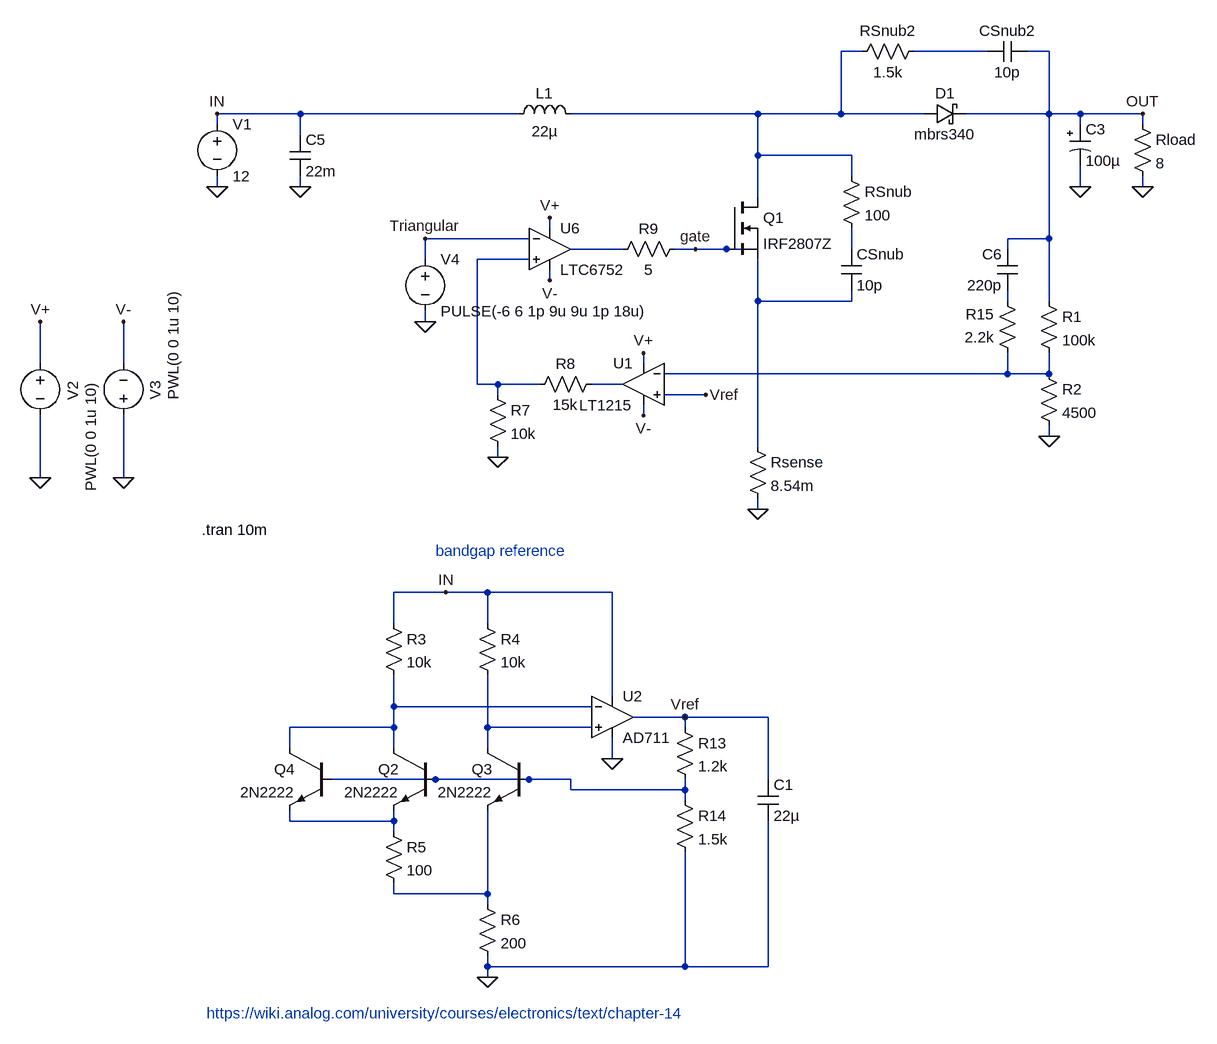
[diagram p0: schematic Boost2_liviana.asc]
Boost2_liviana.asc, the LTspice schematic file:
Version 4
SHEET 1 1128 1560
WIRE 576 -48 544 -48
WIRE 768 -48 656 -48
WIRE 864 -48 832 -48
WIRE -288 48 -416 48
WIRE 48 48 -288 48
WIRE 416 48 128 48
WIRE 544 48 544 -48
WIRE 544 48 416 48
WIRE 672 48 544 48
WIRE 864 48 864 -48
WIRE 864 48 736 48
WIRE 912 48 864 48
WIRE 1008 48 912 48
WIRE -416 64 -416 48
WIRE 912 64 912 48
WIRE 1008 64 1008 48
WIRE -288 80 -288 48
WIRE 416 112 416 48
WIRE 560 112 416 112
WIRE 560 144 560 112
WIRE -416 160 -416 144
WIRE -288 160 -288 144
WIRE 912 160 912 128
WIRE 1008 160 1008 144
WIRE 416 176 416 112
WIRE 96 224 96 208
WIRE 64 240 -96 240
WIRE 864 240 864 48
WIRE 864 240 800 240
WIRE 208 256 128 256
WIRE 320 256 288 256
WIRE 368 256 320 256
WIRE 400 256 368 256
WIRE 560 256 560 224
WIRE 800 256 800 240
WIRE -96 272 -96 240
WIRE 64 272 -16 272
WIRE 96 304 96 288
WIRE 416 336 416 272
WIRE 560 336 560 320
WIRE 560 336 416 336
WIRE 800 336 800 320
WIRE 864 336 864 240
WIRE -96 368 -96 352
WIRE -688 432 -688 368
WIRE -560 432 -560 368
WIRE 240 432 240 416
WIRE 800 448 800 416
WIRE 800 448 272 448
WIRE 864 448 864 416
WIRE 864 448 800 448
WIRE -16 464 -16 272
WIRE 16 464 -16 464
WIRE 80 464 16 464
WIRE 208 464 160 464
WIRE 16 480 16 464
WIRE 336 480 272 480
WIRE 240 512 240 496
WIRE 864 544 864 528
WIRE 416 560 416 336
WIRE 16 576 16 560
WIRE -688 608 -688 512
WIRE -560 608 -560 512
WIRE 416 656 416 640
WIRE -64 784 -144 784
WIRE 0 784 -64 784
WIRE 192 784 0 784
WIRE -144 832 -144 784
WIRE 0 832 0 784
WIRE 192 944 192 784
WIRE -144 960 -144 912
WIRE 160 960 -144 960
WIRE 304 976 224 976
WIRE 432 976 304 976
WIRE -144 992 -144 960
WIRE -144 992 -304 992
WIRE 0 992 0 912
WIRE 160 992 0 992
WIRE 304 992 304 976
WIRE -304 1024 -304 992
WIRE -144 1024 -144 992
WIRE 0 1024 0 992
WIRE 192 1040 192 1008
WIRE -80 1072 -240 1072
WIRE 64 1072 -80 1072
WIRE 128 1072 64 1072
WIRE 432 1072 432 976
WIRE 128 1088 128 1072
WIRE 304 1088 304 1072
WIRE 304 1088 128 1088
WIRE 304 1104 304 1088
WIRE -304 1136 -304 1120
WIRE -144 1136 -144 1120
WIRE -144 1136 -304 1136
WIRE -144 1152 -144 1136
WIRE -144 1248 -144 1232
WIRE 0 1248 0 1120
WIRE 0 1248 -144 1248
WIRE 0 1264 0 1248
WIRE 0 1360 0 1344
WIRE 304 1360 304 1184
WIRE 304 1360 0 1360
WIRE 432 1360 432 1136
WIRE 432 1360 304 1360
WIRE 0 1376 0 1360
FLAG -416 160 0
FLAG 912 160 0
FLAG 1008 160 0
FLAG 864 544 0
FLAG 1008 48 OUT
FLAG -416 48 IN
FLAG 416 656 0
FLAG 320 256 gate
FLAG -288 160 0
FLAG -688 608 0
FLAG -560 608 0
FLAG -688 368 V+
FLAG -560 368 V-
FLAG -96 240 Triangular
FLAG 96 208 V+
FLAG 96 304 V-
FLAG 192 1040 0
FLAG 0 1376 0
FLAG 304 976 Vref
FLAG -64 784 IN
FLAG 336 480 Vref
FLAG 240 512 V-
FLAG 240 416 V+
FLAG 16 576 0
FLAG -96 368 0
SYMBOL nmos 368 176 R0
SYMATTR InstName Q1
SYMATTR Value IRF2807Z
SYMBOL ind 32 64 R270
WINDOW 0 32 56 VTop 2
WINDOW 3 5 56 VBottom 2
SYMATTR InstName L1
SYMATTR Value 22µ
SYMBOL voltage -416 48 R0
WINDOW 123 0 0 Left 2
WINDOW 39 0 0 Left 2
SYMATTR InstName V1
SYMATTR Value 12
SYMBOL schottky 672 64 R270
WINDOW 0 32 32 VTop 2
WINDOW 3 0 32 VBottom 2
SYMATTR InstName D1
SYMATTR Value mbrs340
SYMATTR Description Diode
SYMATTR Type diode
SYMBOL polcap 896 64 R0
WINDOW 3 24 56 Left 2
SYMATTR InstName C3
SYMATTR Value 100µ
SYMATTR Description Capacitor
SYMATTR Type cap
SYMATTR SpiceLine V=2 Irms=3 Rser=0.006 Lser=0 mfg="Rubycon" pn="2SLE100M" type="Al electrolytic"
SYMBOL res 848 320 R0
SYMATTR InstName R1
SYMATTR Value 100k
SYMBOL res 848 432 R0
SYMATTR InstName R2
SYMATTR Value 4500
SYMBOL res 992 48 R0
SYMATTR InstName Rload
SYMATTR Value 8
SYMBOL res 400 544 R0
SYMATTR InstName Rsense
SYMATTR Value 8.54m
SYMBOL cap -304 80 R0
SYMATTR InstName C5
SYMATTR Value 22m
SYMBOL res 544 128 R0
SYMATTR InstName RSnub
SYMATTR Value 100
SYMBOL cap 544 256 R0
SYMATTR InstName CSnub
SYMATTR Value 10p
SYMBOL res 560 -32 R270
WINDOW 0 32 56 VTop 2
WINDOW 3 0 56 VBottom 2
SYMATTR InstName RSnub2
SYMATTR Value 1.5k
SYMBOL cap 768 -32 R270
WINDOW 0 32 32 VTop 2
WINDOW 3 0 32 VBottom 2
SYMATTR InstName CSnub2
SYMATTR Value 10p
SYMBOL Opamps\\LT1215 240 400 M0
SYMATTR InstName U1
SYMBOL res 304 240 R90
WINDOW 0 0 56 VBottom 2
WINDOW 3 32 56 VTop 2
SYMATTR InstName R9
SYMATTR Value 5
SYMBOL voltage -688 416 R0
WINDOW 123 0 0 Left 0
WINDOW 39 0 0 Left 0
WINDOW 0 50 43 VRight 2
WINDOW 3 78 43 VRight 2
SYMATTR InstName V2
SYMATTR Value PWL(0 0 1u 10)
SYMBOL voltage -560 528 R180
WINDOW 0 -49 40 VRight 2
WINDOW 3 -77 40 VRight 2
WINDOW 123 0 0 Left 0
WINDOW 39 0 0 Left 0
SYMATTR InstName V3
SYMATTR Value PWL(0 0 1u 10)
SYMBOL OpAmps\\AD711 192 912 R0
SYMATTR InstName U2
SYMBOL npn -80 1024 M0
SYMATTR InstName Q2
SYMATTR Value 2N2222
SYMBOL npn 64 1024 M0
SYMATTR InstName Q3
SYMATTR Value 2N2222
SYMBOL res -160 816 R0
SYMATTR InstName R3
SYMATTR Value 10k
SYMBOL res -16 816 R0
SYMATTR InstName R4
SYMATTR Value 10k
SYMBOL res -160 1136 R0
SYMATTR InstName R5
SYMATTR Value 100
SYMBOL res -16 1248 R0
SYMATTR InstName R6
SYMATTR Value 200
SYMBOL res 288 976 R0
SYMATTR InstName R13
SYMATTR Value 1.2k
SYMBOL res 288 1088 R0
SYMATTR InstName R14
SYMATTR Value 1.5k
SYMBOL npn -240 1024 M0
SYMATTR InstName Q4
SYMATTR Value 2N2222
SYMBOL res 0 464 R0
SYMATTR InstName R7
SYMATTR Value 10k
SYMBOL res 176 448 R90
WINDOW 0 0 56 VBottom 2
WINDOW 3 32 56 VTop 2
SYMATTR InstName R8
SYMATTR Value 15k
SYMBOL Comparators\\LTC6752 96 192 R0
SYMATTR InstName U6
SYMBOL voltage -96 256 R0
WINDOW 123 0 0 Left 0
WINDOW 39 0 0 Left 0
SYMATTR InstName V4
SYMATTR Value PULSE(-6 6 1p 9u 9u 1p 18u)
SYMBOL cap 816 320 R180
WINDOW 0 24 56 Left 2
WINDOW 3 24 8 Left 2
SYMATTR InstName C6
SYMATTR Value 220p
SYMBOL res 816 432 R180
WINDOW 0 36 76 Left 2
WINDOW 3 36 40 Left 2
SYMATTR InstName R15
SYMATTR Value 2.2k
SYMBOL cap 416 1072 R0
SYMATTR InstName C1
SYMATTR Value 22µ
TEXT -440 688 Left 2 !.tran 10m
TEXT -432 1432 Left 2 ;https://wiki.analog.com/university/courses/electronics/text/chapter-14
TEXT -80 720 Left 2 ;bandgap reference

The netlist it stands for:
* Boost2_liviana.asc
M§Q1 N001 gate N006 N006 IRF2807Z
L1 IN N001 22µ
V1 IN 0 12
D1 N001 OUT mbrs340
C3 OUT 0 100µ V=2 Irms=3 Rser=0.006 Lser=0 mfg="Rubycon" pn="2SLE100M" type="Al electrolytic"
R1 OUT N008 100k
R2 N008 0 4500
Rload OUT 0 8
Rsense N006 0 8.54m
C5 IN 0 22m
RSnub N001 N004 100
CSnub N004 N006 10p
RSnub2 N001 N002 1.5k
CSnub2 N002 OUT 10p
XU1 Vref N008 V+ V- N009 LT1215  ; pins In+ In- V+ V- OUT
R9 gate N003 5
V2 V+ 0 PWL(0 0 1u 10)
V3 0 V- PWL(0 0 1u 10)
XU2 N011 N010 IN 0 Vref AD712  ; AD711, pins In+ In- V+ V- OUT
Q2 N010 N012 N013 0 2N2222
Q3 N011 N012 N014 0 2N2222
R3 IN N010 10k
R4 IN N011 10k
R5 N013 N014 100
R6 N014 0 200
R13 Vref N012 1.2k
R14 N012 0 1.5k
Q4 N010 N012 N013 0 2N2222
R7 N005 0 10k
R8 N009 N005 15k
XU6 N005 Triangular V+ V- N003 LTC6752  ; pins In+ In- V+ V- OUT
V4 Triangular 0 PULSE(-6 6 1p 9u 9u 1p 18u)
C6 N007 OUT 220p
R15 N008 N007 2.2k
C1 Vref 0 22µ
.model D D
.lib standard.dio
.model NPN NPN
.model PNP PNP
.lib standard.bjt
.model NMOS NMOS
.model PMOS PMOS
.lib standard.mos
.tran 10m
* https://wiki.analog.com/university/courses/electronics/text/chapter-14
* bandgap reference
.lib LTC.lib
.lib ADI1.lib
.lib LTC7.lib
.backanno
.end